# EAGLE design MYC_FS20 (EAGLE 6.6.0)
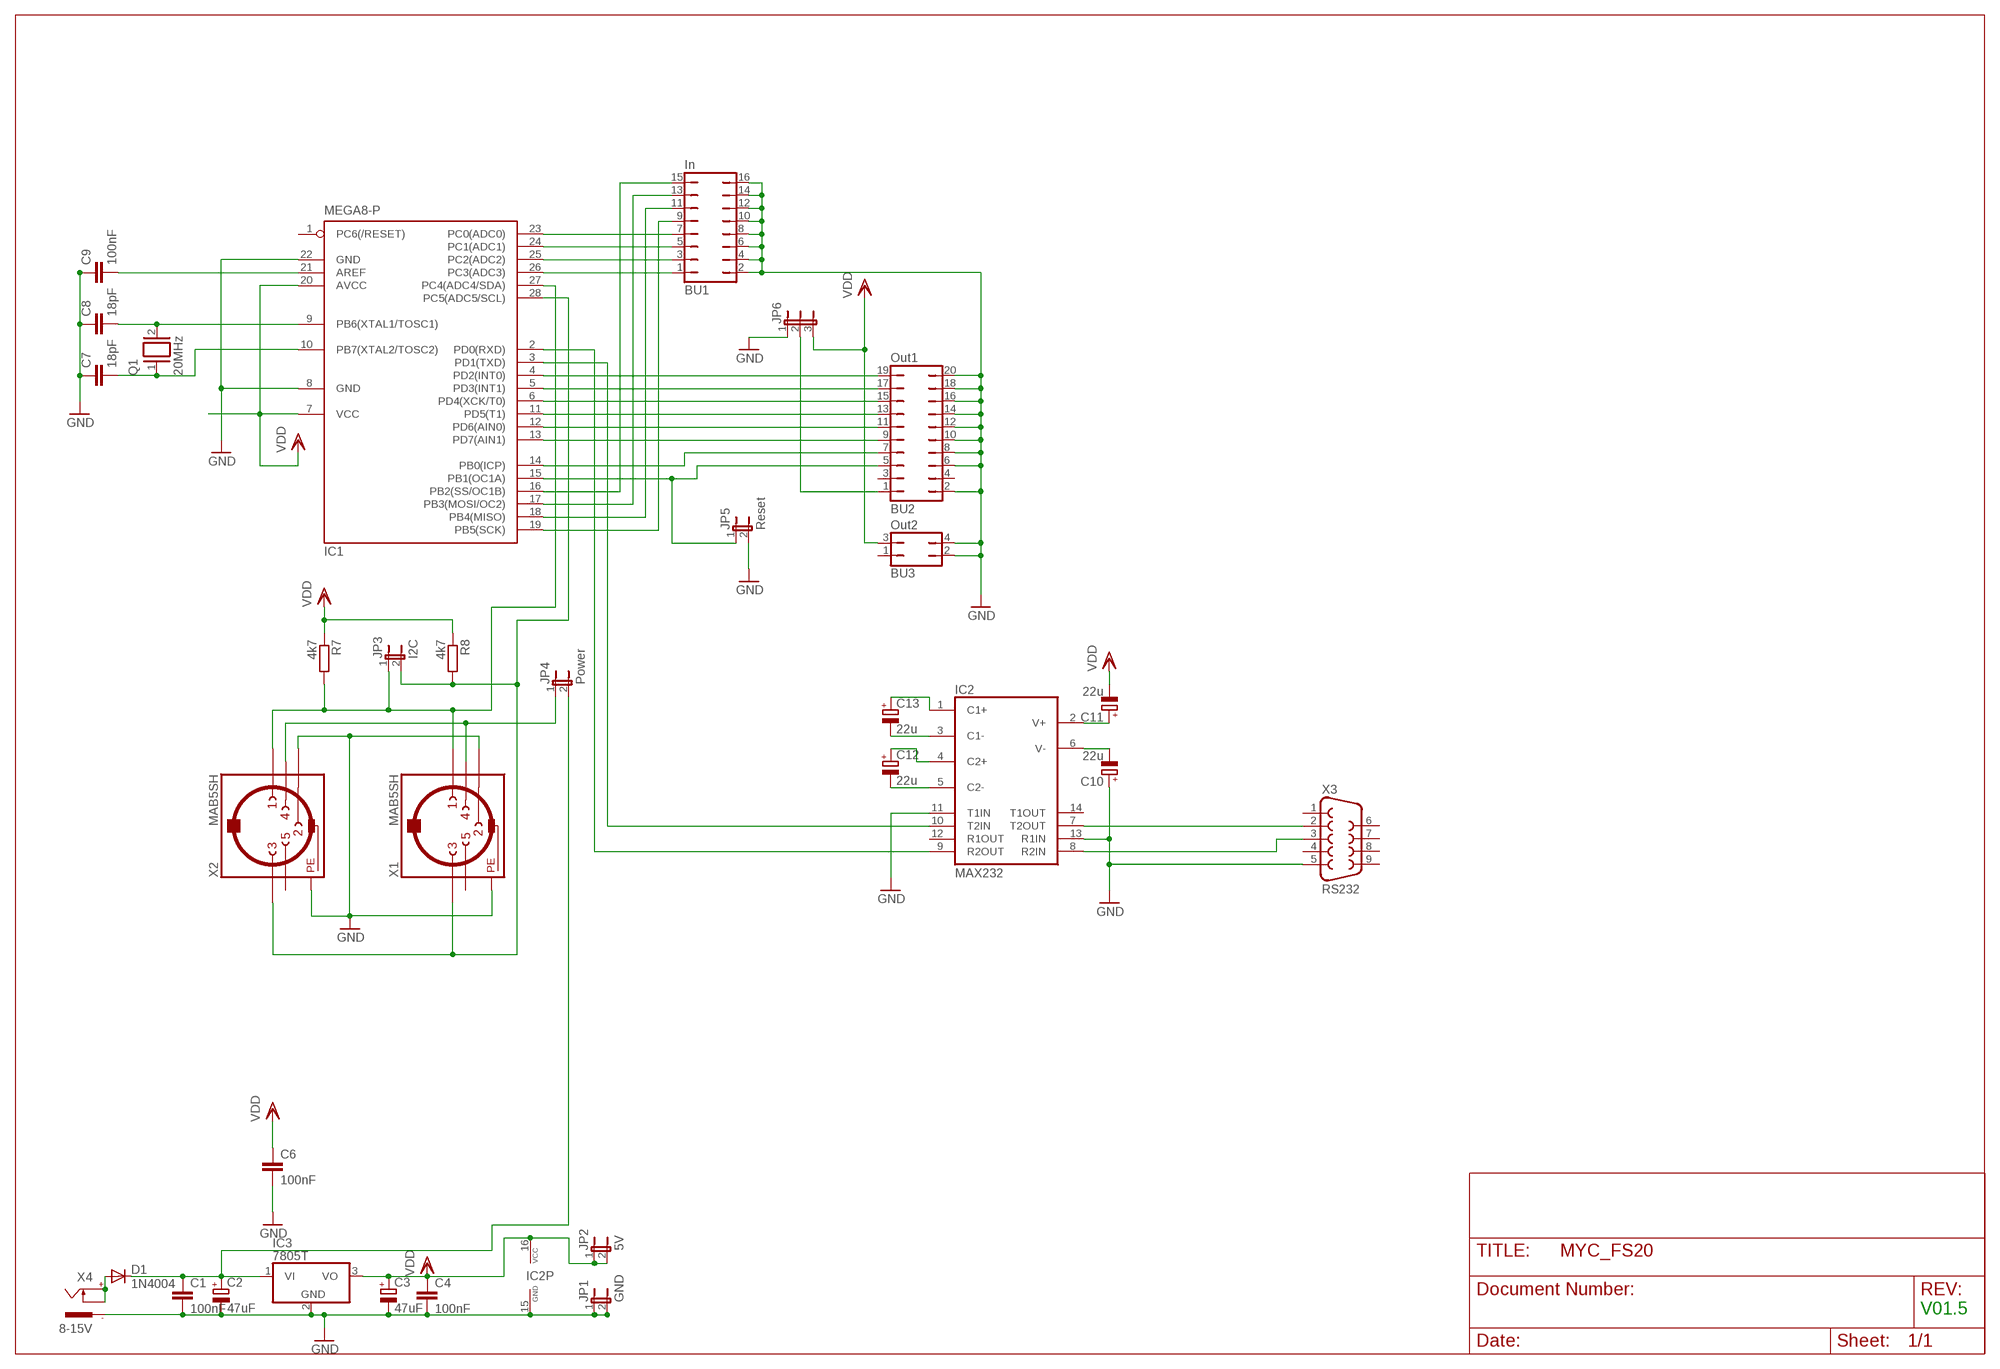
[diagram p0: schematic, sheet 1]

## Parts
BU1  In  JP8Q  [JP8Q]
BU2  Out1  JP10Q  [JP10Q]
BU3  Out2  JP2Q  [JP2Q]
C1  100nF  C-EU050-025X075  [C050-025X075]
C2  47uF  CPOL-EUTT5D10  [TT5D10]
C3  47uF  CPOL-EUTT5D10  [TT5D10]
C4  100nF  C-EU050-025X075  [C050-025X075]
C6  100nF  C-EU050-025X075  [C050-025X075]
C7  18pF  C-EU050-025X075  [C050-025X075]
C8  18pF  C-EU050-025X075  [C050-025X075]
C9  100nF  C-EU050-025X075  [C050-025X075]
C10  22u  CPOL-EUTT5D7  [TT5D7]
C11  22u  CPOL-EUTT5D7  [TT5D7]
C12  22u  CPOL-EUTT5D7  [TT5D7]
C13  22u  CPOL-EUTT5D7  [TT5D7]
D1  1N4004  [DO41-10]
IC1  MEGA8-P  [DIL28-3]
IC2  MAX232  [DIL16]
IC3  7805T  [TO220H]
JP1  GND  JP1E  [JP1]
JP2  5V  JP1E  [JP1]
JP3  I2C  JP1E  [JP1]
JP4  Power  JP1E  [JP1]
JP5  Reset  JP1E  [JP1]
JP6  JP2E  [JP2]
Q1  20MHz  XTAL/S  [QS]
R7  4k7  R-EU_0207/5V  [0207/5V]
R8  4k7  R-EU_0207/5V  [0207/5V]
X1  MAB5SH  [MAB5SH]
X2  MAB5SH  [MAB5SH]
X3  RS232  F09H  [F09H]
X4  8-15V  737992-55  [737992-5]

## Nets
C13: C13.+ IC2.1(C1+)
GND: BU1.2 BU1.4 BU1.6 BU1.8 BU1.10 BU1.12 BU1.14 BU1.16 BU2.2 BU2.6 BU2.8 BU2.10 BU2.12 BU2.14 BU2.16 BU2.18 BU2.20 BU3.2 BU3.4 C1.2 C2.- C3.- C4.2 C6.2 C7.1 C8.1 C9.1 C10.+ IC1.8(GND) IC1.22(GND) IC2.11(T1IN) IC2.13(R1IN) IC2.15(GND) IC3.2(GND) JP1.1 JP1.2 JP5.2 JP6.1 X1.2 X1.PE X1.PE@(PE) X2.2 X2.PE X2.PE@(PE) X3.5 X4.-1
N$1: JP4.1 X1.4 X2.4
N$2: IC1.2(PD0(RXD)) IC2.9(R2OUT)
N$3: C12.- IC2.5(C2-)
N$4: BU2.11 IC1.12(PD6(AIN0))
N$5: IC1.27(PC4(ADC4/SDA)) JP3.1 R7.2 X1.1 X2.1
N$6: BU1.1 IC1.26(PC3(ADC3))
N$7: D1.A X4.+ X4.K
N$8: BU2.7 IC1.14(PB0(ICP))
N$9: BU2.1 JP6.2
N$11: IC2.8(R2IN) X3.3
N$12: IC1.3(PD1(TXD)) IC2.10(T2IN)
N$13: C12.+ IC2.4(C2+)
N$14: C13.- IC2.3(C1-)
N$15: BU1.3 IC1.25(PC2(ADC2))
N$16: C11.+ IC2.2(V+)
N$17: C10.- IC2.6(V-)
N$18: BU2.5 IC1.15(PB1(OC1A)) JP5.1
N$19: C8.2 IC1.9(PB6(XTAL1/TOSC1)) Q1.2
N$20: BU1.5 IC1.24(PC1(ADC1))
N$21: BU2.9 IC1.13(PD7(AIN1))
N$22: IC1.28(PC5(ADC5/SCL)) JP3.2 R8.2 X1.3 X2.3
N$24: BU1.7 IC1.23(PC0(ADC0))
N$25: BU2.13 IC1.11(PD5(T1))
N$26: BU2.15 IC1.6(PD4(XCK/T0))
N$27: IC2.7(T2OUT) X3.2
N$28: BU2.17 IC1.5(PD3(INT1))
N$29: BU2.19 IC1.4(PD2(INT0))
N$32: BU1.15 IC1.16(PB2(SS/OC1B))
N$33: C1.1 C2.+ D1.C IC3.1(VI) JP4.2
N$34: BU1.13 IC1.17(PB3(MOSI/OC2))
N$35: C9.2 IC1.21(AREF)
N$36: BU1.11 IC1.18(PB4(MISO))
N$37: C7.2 IC1.10(PB7(XTAL2/TOSC2)) Q1.1
N$38: BU1.9 IC1.19(PB5(SCK))
VDD: BU3.3 C3.+ C4.1 C6.1 C11.- IC1.7(VCC) IC1.20(AVCC) IC2.16(VCC) IC3.3(VO) JP2.1 JP2.2 JP6.3 R7.1 R8.1
Unconnected: BU2.3 BU2.4 BU3.1 IC1.1(PC6(/RESET)) IC2.12(R1OUT) IC2.14(T1OUT) X1.5 X2.5 X3.1 X3.4 X3.6 X3.7 X3.8 X3.9 X4.-2

## Notes on the sheet
- V01.5

## Library data of the parts
BU1 = jumper:JP8Q: JUMPER
BU2 = jumper:JP10Q: JUMPER
BU3 = jumper:JP2Q: JUMPER
C1 C4 C6-C9 = resistor:C-EU: CAPACITOR, European symbol
C2 C3 C10-C13 = rcl:CPOL-EU: POLARIZED CAPACITOR, European symbol
D1 = diode:1N4004: DIODE general purpose rectifier, 1 A
IC1 = atmel:MEGA8-P: MICROCONTROLLER 8 Kbytes FLASH, 1 kbytes SRAM, 512 bytes EEPROM, USART, 4-channel 10 bit ADC, 2-channel 8 bit ADC Pin compatible with Atmega48, ATMega88, ATMega168 Source: avr.lbr; OC_FARNELL: unknown; OC_NEWARK: unknown
IC2 = maxim:MAX232: RS232 TRANSEIVER; MF: MAXIM; MPN: MAX232ACPE+; OC_FARNELL: 9723773; OC_NEWARK: 68K4544
IC3 = linear:78*: Positive VOLTAGE REGULATOR Source: http://cache.national.com/ds/LM/LM78L05.pdf http://www.fairchildsemi.com/ds/LM/LM7805.pdf
JP1-JP5 = jumper:JP1E: JUMPER
JP6 = jumper:JP2E: JUMPER
Q1 = special:XTAL/S: CRYSTAL
R7 R8 = resistor:R-EU_: RESISTOR, European symbol
X1 X2 = con-hirschmann:MAB5SH: Female CONNECTOR 5 pins 90 deg. with shield, horizontal (DIN 41524); OC_FARNELL: 809883; OC_NEWARK: unknown
X3 = con-subd:F09: SUB-D; OC_FARNELL: unknown; OC_NEWARK: unknown
X4 = con-conrad:737992-55: FEMALE PRINT CONNECTOR DIN 45323 (34V/3A), ROKA, distributor Conrad

## Board
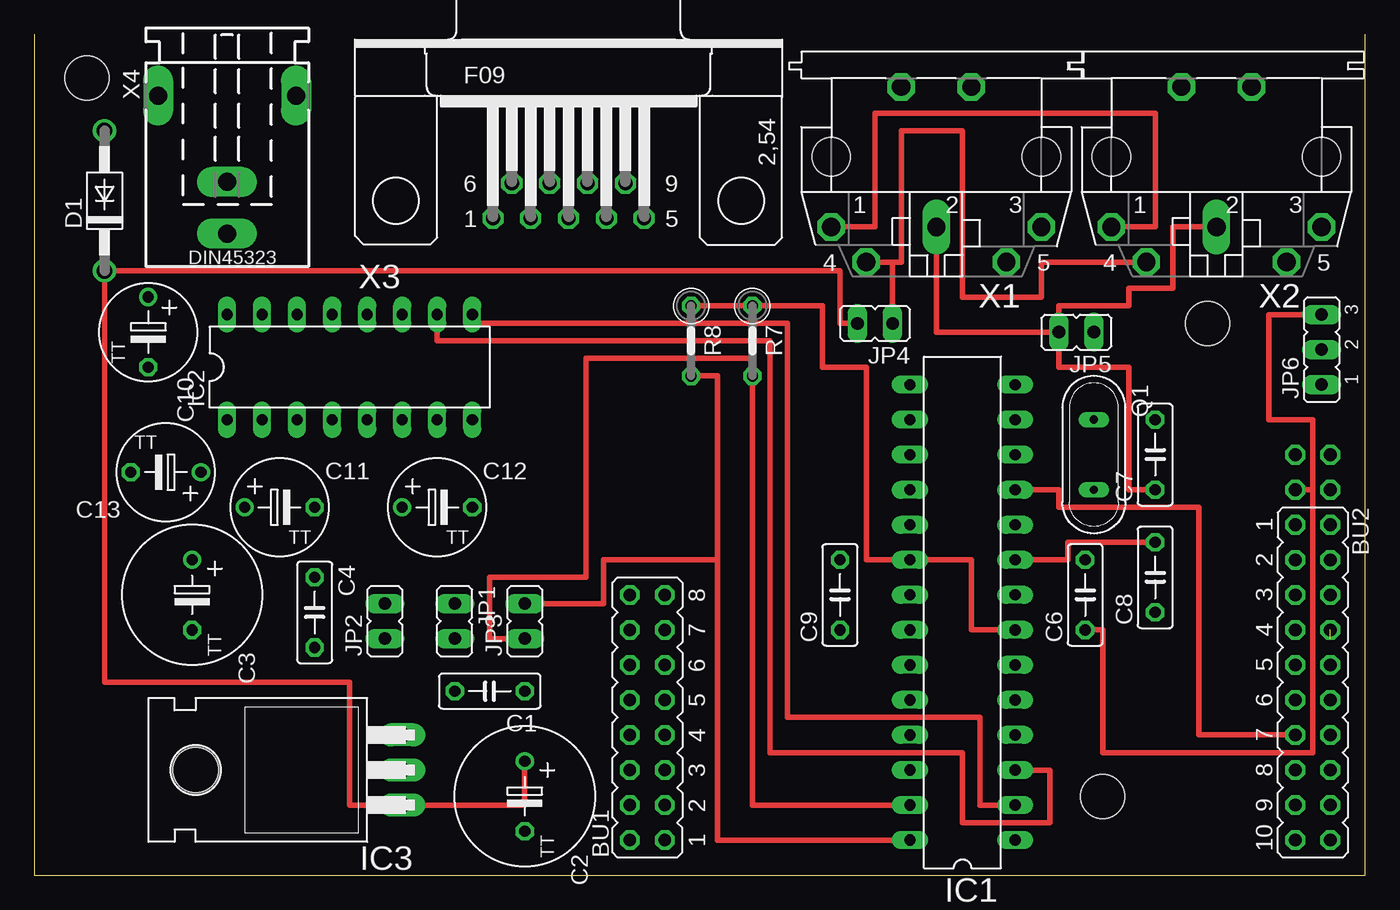
[diagram p1: board, top side]
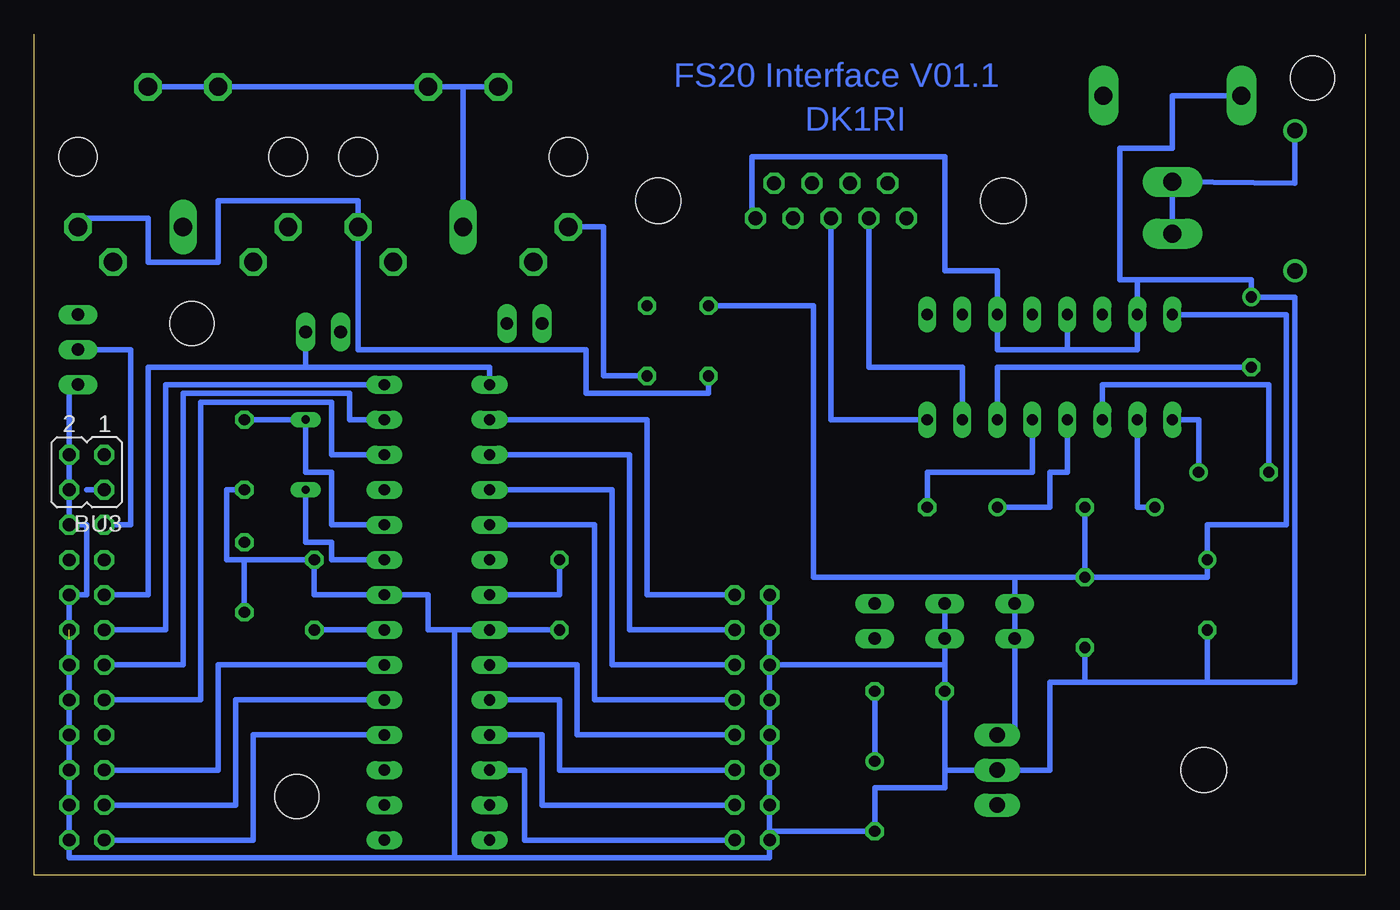
[diagram p2: board, bottom side, seen from below]

Size 96.5 x 60.95 mm. Coordinates in mm from the lower left corner, seen from the top.
Outline: 96.5,60.95 96.5,0 0,0 0,60.95
Copper layers (1*16): Top 0.035mm / dielectric 1.5mm / Bottom 0.035mm
Design rules "default": minimum track width 10mil, minimum drill 24mil, track to track 8mil, track to pad 8mil, pad to pad 8mil, via to via 8mil, smd to smd 8mil, copper to edge 40mil, drill to drill 8mil, minimum pad ring 10mil, minimum via ring 8mil, stop-mask expansion 4mil, vias tented up to drill 0mil, thermal gap 10mil
Holes 3.2 mm at 3.81,57.78 85.09,40.01 77.47,5.71

### Footprints (pad centres in the part's own frame; a part is rotated, then mirrored left to right if it is on the bottom)
JP8Q = drill 0.914 octagon: 1 -8.89,-1.27; 2 -8.89,1.27; 3 -6.35,-1.27; 4 -6.35,1.27; 5 -3.81,-1.27; 6 -3.81,1.27; 7 -1.27,-1.27; 8 -1.27,1.27; 9 1.27,-1.27; 10 1.27,1.27; 11 3.81,-1.27; 12 3.81,1.27; 13 6.35,-1.27; 14 6.35,1.27; 15 8.89,-1.27; 16 8.89,1.27
JP10Q = drill 0.914 octagon: 1 -11.43,-1.27; 2 -11.43,1.27; 3 -8.89,-1.27; 4 -8.89,1.27; 5 -6.35,-1.27; 6 -6.35,1.27; 7 -3.81,-1.27; 8 -3.81,1.27; 9 -1.27,-1.27; 10 -1.27,1.27; 11 1.27,-1.27; 12 1.27,1.27; 13 3.81,-1.27; 14 3.81,1.27; 15 6.35,-1.27; 16 6.35,1.27; 17 8.89,-1.27; 18 8.89,1.27; 19 11.43,-1.27; 20 11.43,1.27
JP2Q = drill 0.914 octagon: 1 -1.27,-1.27; 2 1.27,-1.27; 3 -1.27,1.27; 4 1.27,1.27
C050-025X075 = drill 0.813 octagon: 1 -2.54,0; 2 2.54,0
TT5D10 = drill 0.813: + -2.54,0 | drill 0.813 octagon: - 2.54,0
TT5D7 = drill 0.813: + -2.54,0 | drill 0.813 octagon: - 2.54,0
DO41-10 = drill 1.118: A 5.08,0; C -5.08,0
DIL28-3 = drill 0.813 long: 1 -16.51,-3.81; 2 -13.97,-3.81; 3 -11.43,-3.81; 4 -8.89,-3.81; 5 -6.35,-3.81; 6 -3.81,-3.81; 7 -1.27,-3.81; 8 1.27,-3.81; 9 3.81,-3.81; 10 6.35,-3.81; 11 8.89,-3.81; 12 11.43,-3.81; 13 13.97,-3.81; 14 16.51,-3.81; 15 16.51,3.81; 16 13.97,3.81; 17 11.43,3.81; 18 8.89,3.81; 19 6.35,3.81; 20 3.81,3.81; 21 1.27,3.81; 22 -1.27,3.81; 23 -3.81,3.81; 24 -6.35,3.81; 25 -8.89,3.81; 26 -11.43,3.81; 27 -13.97,3.81; 28 -16.51,3.81
DIL16 = drill 0.813 long: 1 -8.89,-3.81; 2 -6.35,-3.81; 3 -3.81,-3.81; 4 -1.27,-3.81; 5 1.27,-3.81; 6 3.81,-3.81; 7 6.35,-3.81; 8 8.89,-3.81; 9 8.89,3.81; 10 6.35,3.81; 11 3.81,3.81; 12 1.27,3.81; 13 -1.27,3.81; 14 -3.81,3.81; 15 -6.35,3.81; 16 -8.89,3.81
TO220H = drill 1.118 long: 1 -2.54,-10.16; 2 0,-10.16; 3 2.54,-10.16 | hole 3.302: 0,4.826
JP1 = drill 0.914 long: 1 0,-1.27; 2 0,1.27
JP2 = drill 0.914 long: 1 -2.54,0; 2 0,0; 3 2.54,0
QS = drill 0.61 long: 1 -2.54,0; 2 2.54,0
0207/5V = drill 0.813 octagon: 1 -2.54,0; 2 2.54,0
MAB5SH = drill 1.321 octagon: 1 7.62,5.08; 3 -7.62,5.08; 4 5.08,7.62; 5 -5.08,7.62; PE -2.54,-5.08; PE@ 2.54,-5.08 | drill 1.321 long: 2 0,5.08 | hole 2.794: 7.62,0; -7.62,0
F09H = drill 1.016 octagon: 1 -5.486,-1.27; 2 -2.743,-1.27; 3 0,-1.27; 4 2.743,-1.27; 5 5.486,-1.27; 6 -4.115,1.27; 7 -1.372,1.27; 8 1.372,1.27; 9 4.115,1.27 | hole 3.302: -12.522,0; 12.522,0
737992-5 = drill 1.3 pad 2.184 long: + 0,10; -1 5,0; -2 -5,0; K 0,6.25

### Placement (x,y rotation side)
BU1  44.45,11.43 90 top
BU2  92.71,13.97 270 top
BU3  92.71,29.21 180 bottom
C1  33.02,13.34 180 top
C2  35.56,5.71 270 top
C3  11.43,20.32 270 top
C4  20.32,19.05 270 top
C6  76.2,20.32 90 top
C7  81.28,30.48 90 top
C8  81.28,21.59 90 top
C9  58.42,20.32 90 top
C10  8.26,39.37 270 top
C11  17.78,26.67 0 top
C12  29.21,26.67 0 top
C13  9.53,29.21 180 top
D1  5.08,48.9 90 top
IC1  67.31,19.05 90 top
IC2  22.86,36.83 0 top
IC3  16.51,7.62 90 top
JP1  30.48,18.41 180 top
JP2  25.4,18.41 0 top
JP3  35.56,18.41 0 top
JP4  60.96,40.01 90 top
JP5  75.56,39.37 90 top
JP6  93.34,38.1 90 top
Q1  76.83,30.48 270 top
R7  52.07,38.73 270 top
R8  47.62,38.73 270 top
X1  65.41,52.07 180 top
X2  85.72,52.07 180 top
X3  38.73,48.9 0 top
X4  13.97,56.52 180 top

### Tracks (layer width: path | path; a pad name or v marks a point on that pad's centre or on a via)
C13
  Bottom 0.406: C13.+ 12.06,33.02 IC2.1
GND  (1 unrouted)
  Top 0.406: JP5.2 65.41,39.37 X1.2 | JP5.2 74.3,41.27 79.38,41.27 79.38,42.55 82.55,42.55 82.55,46.99 X2.2 | JP5.2 74.3,36.83 79.38,36.83 79.38,27.94 C7.1
  Bottom 0.406: C1.2 30.48,7.62 IC3.2 22.86,7.62 22.86,13.97 20.32,13.97 | 11.43,13.97 5.08,13.97 5.08,41.91 C10.+ 8.26,43.18 16.51,43.18 | 11.43,13.97 20.32,13.97 | X1.PE@ X1.PE | X2.PE X2.PE@ X1.PE | X1.PE 65.41,57.15 X1.2 | 66.04,17.78 IC1.22 C9.1 | C3.- 11.43,13.97 | C1.2 30.48,6.35 35.56,6.35 C2.- 43.18,3.17 BU1.2 | 21.59,38.1 16.51,38.1 IC2.15 16.51,43.18 | IC2.13 21.59,38.1 | 21.59,38.1 26.67,38.1 IC2.11 26.67,43.81 30.48,43.81 30.48,52.07 44.45,52.07 44.45,47.62 X3.5 | X4.-1 13.97,56.52 13.97,52.7 17.78,52.7 17.78,43.18 16.51,43.18 | JP1.1 JP1.2 30.48,15.24 | 30.48,15.24 C1.2 | 93.98,17.14 BU2.10 BU2.12 BU2.14 BU2.16 BU2.18 BU2.20 93.98,1.27 66.04,1.27 | BU2.8 BU2.6 92.71,20.32 92.71,25.4 BU2.2 BU3.4 BU3.2 93.98,35.56 JP6.1 | BU1.2 BU1.4 BU1.6 BU1.8 BU1.10 BU1.12 | BU1.16 BU1.14 BU1.12 | C4.2 20.32,13.97 | C7.1 82.55,27.94 82.55,22.86 81.28,22.86 | BU1.12 30.48,15.24 | 66.04,1.27 43.18,1.27 BU1.2 | C8.1 81.28,22.86 | 81.28,22.86 C6.2 76.2,20.32 IC1.8 67.94,20.32 67.94,17.78 66.04,17.78 | 66.04,17.78 66.04,1.27
N$1
  Top 0.406: X2.4 73.03,44.45 73.03,41.91 67.31,41.91 67.31,53.98 62.87,53.98 62.87,44.45 X1.4 62.23,44.45 JP4.1
N$2
  Top 0.406: IC2.9 31.75,40.01 54.61,40.01 54.61,11.43 68.58,11.43 68.58,5.08 IC1.2
N$3
  Bottom 0.406: IC2.5 24.13,29.21 31.75,29.21 C12.-
N$4
  Bottom 0.406: BU2.11 84.45,12.7 84.45,34.29 74.93,34.29 74.93,30.48 IC1.12
N$5
  Top 0.406: X1.1 60.96,46.99 60.96,55.24 81.28,55.24 81.28,46.99 X2.1 | JP3.1 33.02,17.14 33.02,21.59 40.01,21.59 40.01,37.47 52.07,37.47 R7.2 52.07,5.08 IC1.27
  Bottom 0.406: R7.2 55.24,36.2 55.24,46.99 X1.1
N$6
  Bottom 0.406: BU1.1 60.96,2.54 60.96,7.62 IC1.26
N$7
  Bottom 0.406: X4.+ X4.K 5.08,50.16 D1.A
N$8
  Bottom 0.406: IC1.14 87,35.56 87,17.78 BU2.7
N$9
  Bottom 0.406: BU2.1 89.53,25.4 89.53,38.1 JP6.2
N$11
  Bottom 0.406: IC2.8 38.73,33.02 X3.3
N$12
  Top 0.406: IC2.10 29.21,38.73 53.34,38.73 53.34,8.89 67.31,8.89 67.31,3.81 73.66,3.81 73.66,7.62 IC1.3
N$13
  Bottom 0.406: IC2.4 21.59,29.21 22.86,29.21 22.86,26.67 C12.+
N$14
  Bottom 0.406: C13.- 6.99,35.56 19.05,35.56 IC2.3
N$15
  Bottom 0.406: BU1.3 59.69,5.08 59.69,10.16 IC1.25
N$16
  Bottom 0.406: C11.+ 16.51,26.67 IC2.2
N$17
  Bottom 0.406: IC2.6 26.67,36.83 C10.-
N$18
  Bottom 0.406: IC1.15 63.5,36.83 76.83,36.83 | 76.83,36.83 88.27,36.83 88.27,20.32 BU2.5 | JP5.1 76.83,36.83
N$19
  Top 0.406: C8.2 74.93,24.13 74.93,22.86 IC1.9
  Bottom 0.406: Q1.2 76.83,24.13 74.93,24.13 74.93,22.86 IC1.9
N$20
  Bottom 0.406: BU1.5 58.42,7.62 58.42,12.7 IC1.24
N$21
  Bottom 0.406: IC1.13 73.66,33.02 73.66,34.92 85.72,34.92 85.72,15.24 BU2.9
N$22
  Top 0.406: IC1.28 49.53,2.54 49.53,22.86 | 49.53,22.86 49.53,36.2 R8.2 | JP3.2 41.27,19.68 41.27,22.86 49.53,22.86
  Bottom 0.406: X2.3 93.34,47.62 88.27,47.62 88.27,44.45 83.19,44.45 83.19,48.9 73.03,48.9 X1.3 73.03,38.1 56.52,38.1 56.52,34.92 47.62,34.92 R8.2
N$24
  Bottom 0.406: BU1.7 57.15,10.16 57.15,15.24 IC1.23
N$25
  Top 0.406: IC1.11 74.3,27.94 74.3,26.67 84.45,26.67 84.45,10.16 BU2.13
N$26
  Bottom 0.406: IC1.6 83.19,15.24 83.19,7.62 BU2.15
N$27
  Bottom 0.406: IC2.7 29.21,36.83 35.99,36.83 X3.2
N$28
  Bottom 0.406: BU2.17 81.92,5.08 81.92,12.7 IC1.5
N$29
  Bottom 0.406: IC1.4 80.64,10.16 80.64,2.54 BU2.19
N$32
  Bottom 0.406: BU1.15 52.07,20.32 52.07,33.02 IC1.16
N$33
  Top 0.406: IC3.1 22.86,5.08 22.86,13.97 5.08,13.97 D1.C 58.42,43.81 58.42,40.01 JP4.2 | 26.67,4.45 IC3.1 | IC3.1 35.56,5.08 C2.+
  Bottom 0.406: C1.1 C2.+
N$34
  Bottom 0.406: IC1.17 53.34,30.48 53.34,17.78 BU1.13
N$35
  Bottom 0.406: IC1.21 58.42,20.32 C9.2
N$36
  Bottom 0.406: BU1.11 54.61,15.24 54.61,27.94 IC1.18
N$37
  Bottom 0.406: IC1.10 74.93,25.4 74.93,29.21 76.83,29.21 Q1.1 C7.2
N$38
  Bottom 0.406: BU1.9 55.88,12.7 55.88,25.4 IC1.19
VDD
  Top 0.406: 25.4,10.16 IC3.3 | R8.1 R7.1 57.15,41.27 57.15,36.83 60.33,36.83 60.33,22.86 IC1.20 67.94,22.86 67.94,17.78 IC1.7 | C6.1 77.47,17.78 77.47,8.89 92.71,8.89 92.71,27.94 | 92.71,27.94 BU3.3 | JP6.3 89.53,40.64 89.53,33.02 92.71,33.02 92.71,27.94
  Bottom 0.406: JP2.1 JP2.2 | 25.4,21.59 C4.1 | IC3.3 25.4,10.16 JP2.2 | C11.- C4.1 | IC2.16 5.71,40.64 5.71,25.4 11.43,25.4 C3.+ 11.43,21.59 C4.1 | C6.1 IC1.7 | 25.4,21.59 40.01,21.59 40.01,41.27 R8.1 | 92.71,27.94 BU3.3 | JP2.2 25.4,21.59

### Text on the board
Bottom: FS20 Interface V01.1 | DK1RI